# EAGLE schematic motorschem v2 (EAGLE 9.7.0)
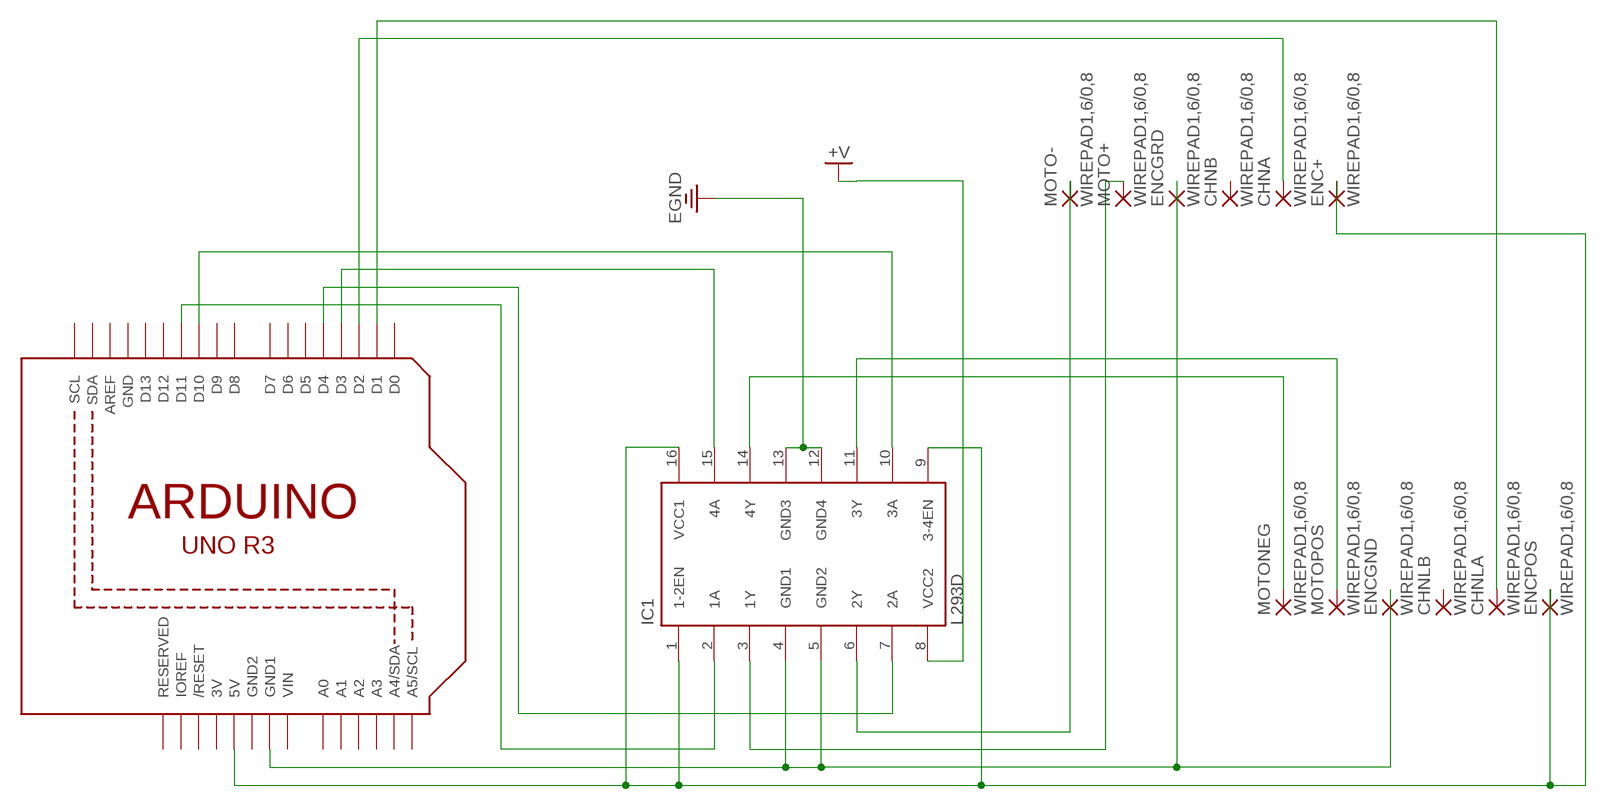
[diagram p0: schematic, sheet 1]

## Parts
CHNA  WIREPAD1,6/0,8  [1,6/0,8]
CHNB  WIREPAD1,6/0,8  [1,6/0,8]
CHNLA  WIREPAD1,6/0,8  [1,6/0,8]
CHNLB  WIREPAD1,6/0,8  [1,6/0,8]
ENC+  WIREPAD1,6/0,8  [1,6/0,8]
ENCGND  WIREPAD1,6/0,8  [1,6/0,8]
ENCGRD  WIREPAD1,6/0,8  [1,6/0,8]
ENCPOS  WIREPAD1,6/0,8  [1,6/0,8]
IC1  L293D  [DIL16]
MOTO+  WIREPAD1,6/0,8  [1,6/0,8]
MOTO-  WIREPAD1,6/0,8  [1,6/0,8]
MOTONEG  WIREPAD1,6/0,8  [1,6/0,8]
MOTOPOS  WIREPAD1,6/0,8  [1,6/0,8]
U1  ARDUINOR3-BPLACE  [ARDUINOR3-BPLACE]

## Nets
+V: IC1.8(VCC2)
EGND: IC1.12(GND4) IC1.13(GND3)
N$1: ENCGND.1(P) ENCGRD.1(P) IC1.4(GND1) IC1.5(GND2) U1.GND1
N$2: ENC+.1(P) ENCPOS.1(P) IC1.1(1-2EN) IC1.9(3-4EN) IC1.16(VCC1) U1.5V
N$4: IC1.3(1Y) MOTO+.1(P)
N$5: IC1.6(2Y) MOTO-.1(P)
N$6: IC1.2(1A) U1.D11
N$7: IC1.7(2A) U1.D4
N$8: IC1.15(4A) U1.D3
N$9: IC1.14(4Y) MOTONEG.1(P)
N$10: IC1.11(3Y) MOTOPOS.1(P)
N$11: IC1.10(3A) U1.D10
N$12: CHNA.1(P) U1.D2
N$13: CHNLA.1(P) U1.D1
Unconnected: CHNB.1(P) CHNLB.1(P) U1.A0 U1.A1 U1.A2 U1.A3 U1.A4(A4/SDA) U1.A5(A5/SCL) U1.AREF U1.D0 U1.D5 U1.D6 U1.D7 U1.D8 U1.D9 U1.D12 U1.D13 U1.IOREF U1.RESERVED U1.RESET(/RESET) U1.SCL U1.SDA

## Power pins joined to a net without a drawn wire
3V: U1.3V
GND: U1.GND
GND2: U1.GND2
VIN: U1.VIN

## Library data of the parts
CHNA CHNB CHNLA CHNLB ENC+ ENCGND ENCGRD ENCPOS MOTO+ MOTO- MOTONEG MOTOPOS = wirepad:WIREPAD: Wire PAD connect wire on PCB
IC1 = st-microelectronics:L293D: PUSH-PULL 4 CHANNEL DRIVER; MPN: L293D; OC_FARNELL: 9589619; OC_NEWARK: 56P8249
U1 = adafruit:ARDUINOR3: This is a new object for the new Arduino R3 - with extra pins that you may want to use (such as IOref, and duplicated A4/A5